# EAGLE schematic Controller (EAGLE 9.2.0)
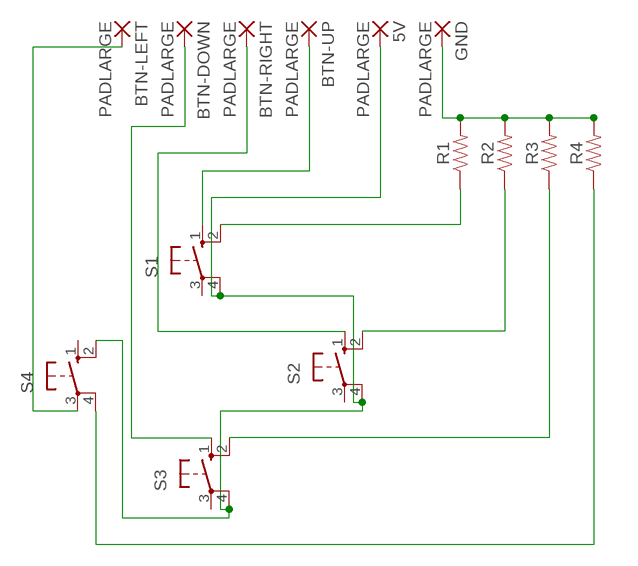
[diagram p0: schematic, sheet 1]

## Parts
5V  PADLARGE  [SMDLARGE]
BTN-DOWN  PADLARGE  [SMDLARGE]
BTN-LEFT  PADLARGE  [SMDLARGE]
BTN-RIGHT  PADLARGE  [SMDLARGE]
BTN-UP  PADLARGE  [SMDLARGE]
GND  PADLARGE  [SMDLARGE]
R1  RESISTORAXIAL-0.3  [AXIAL-0.3]
R2  RESISTORAXIAL-0.3  [AXIAL-0.3]
R3  RESISTORAXIAL-0.3  [AXIAL-0.3]
R4  RESISTORAXIAL-0.3  [AXIAL-0.3]
S1  10-XX  [B3F-10XX]
S2  10-XX  [B3F-10XX]
S3  10-XX  [B3F-10XX]
S4  10-XX  [B3F-10XX]

## Nets
BTN-UP: BTN-UP.P$1(P) S1.1(S)
N$2: BTN-RIGHT.P$1(P) S2.1(S)
N$3: BTN-DOWN.P$1(P) S3.1(S)
N$4: BTN-LEFT.P$1(P) S4.3(P)
N$5: GND.P$1(P) R1.P$2 R2.P$2 R3.P$2 R4.P$2
N$6: R1.P$1 S1.2(S1)
N$7: R2.P$1 S2.2(S1)
N$8: R3.P$1 S3.2(S1)
N$10: R4.P$1 S4.4(P1)
N$11: 5V.P$1(P) S1.4(P1) S2.4(P1) S3.4(P1) S4.2(S1)
Unconnected: S1.3(P) S2.3(P) S3.3(P) S4.1(S)

## Library data of the parts
5V BTN-DOWN BTN-LEFT BTN-RIGHT BTN-UP GND = ENGR294:PADLARGE
R1-R4 = ENGR294:RESISTOR: Generic Resistor Package
S1-S4 = switch-omron:10-XX: OMRON SWITCH; MPN: B3F-1000; OC_FARNELL: 176432; OC_NEWARK: 36M3542